# Altium schematic sheet project_V3.SchDoc
size A0
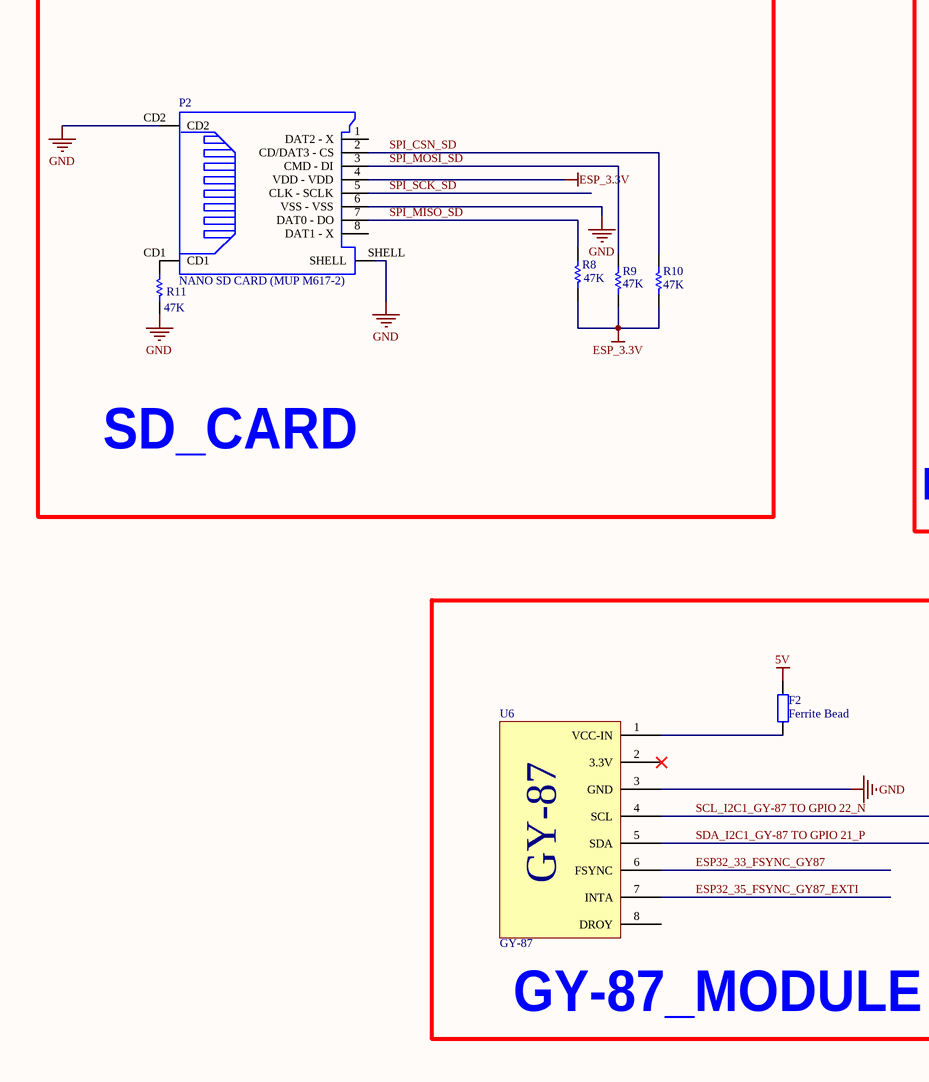
[diagram p0: project_V3.SchDoc, top left]
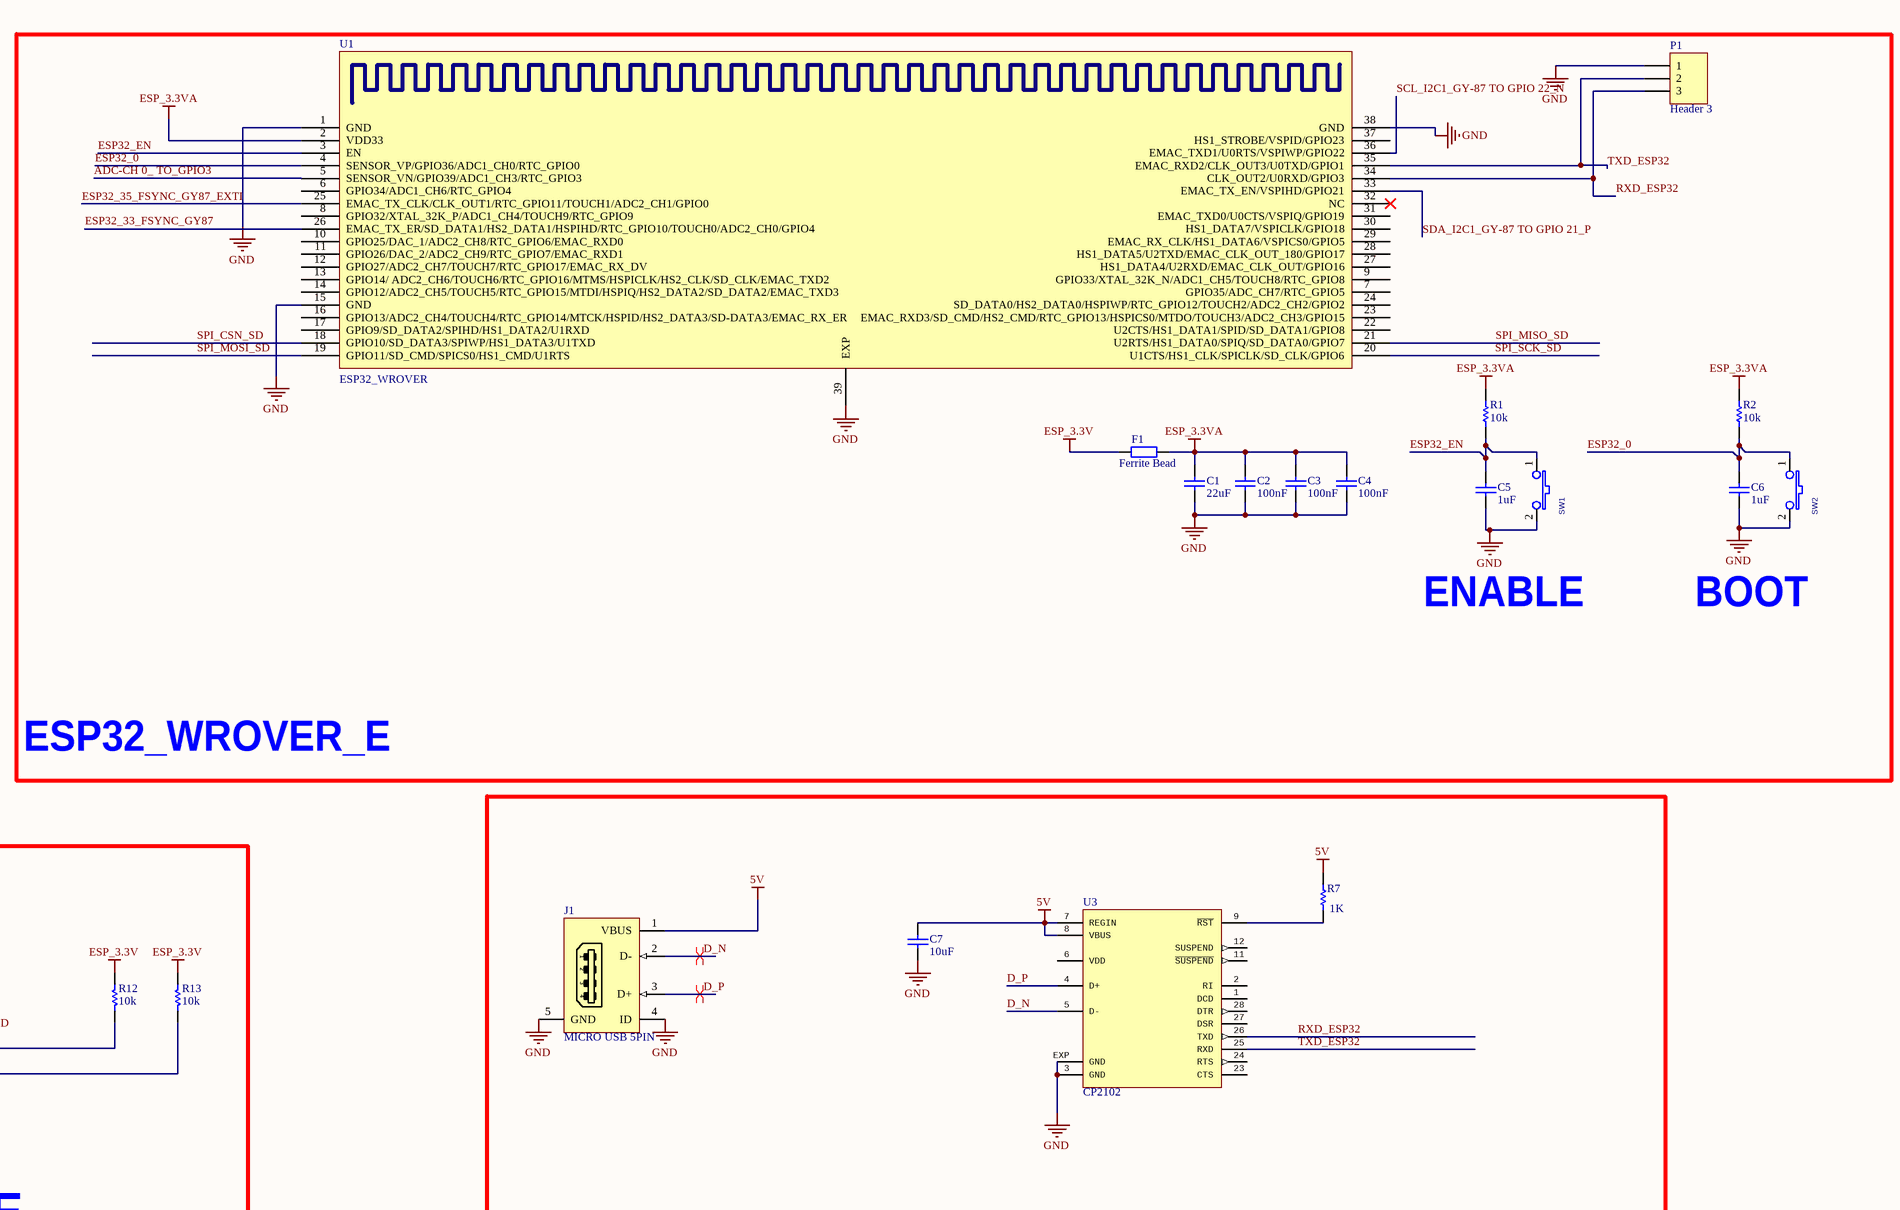
[diagram p1: project_V3.SchDoc, top right]
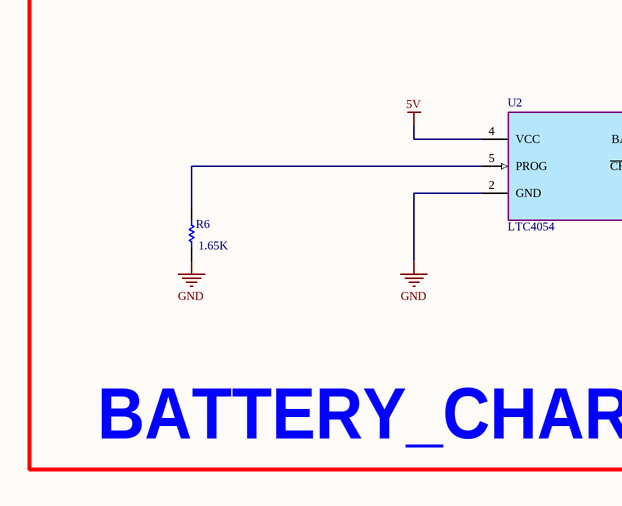
[diagram p2: project_V3.SchDoc, bottom left]
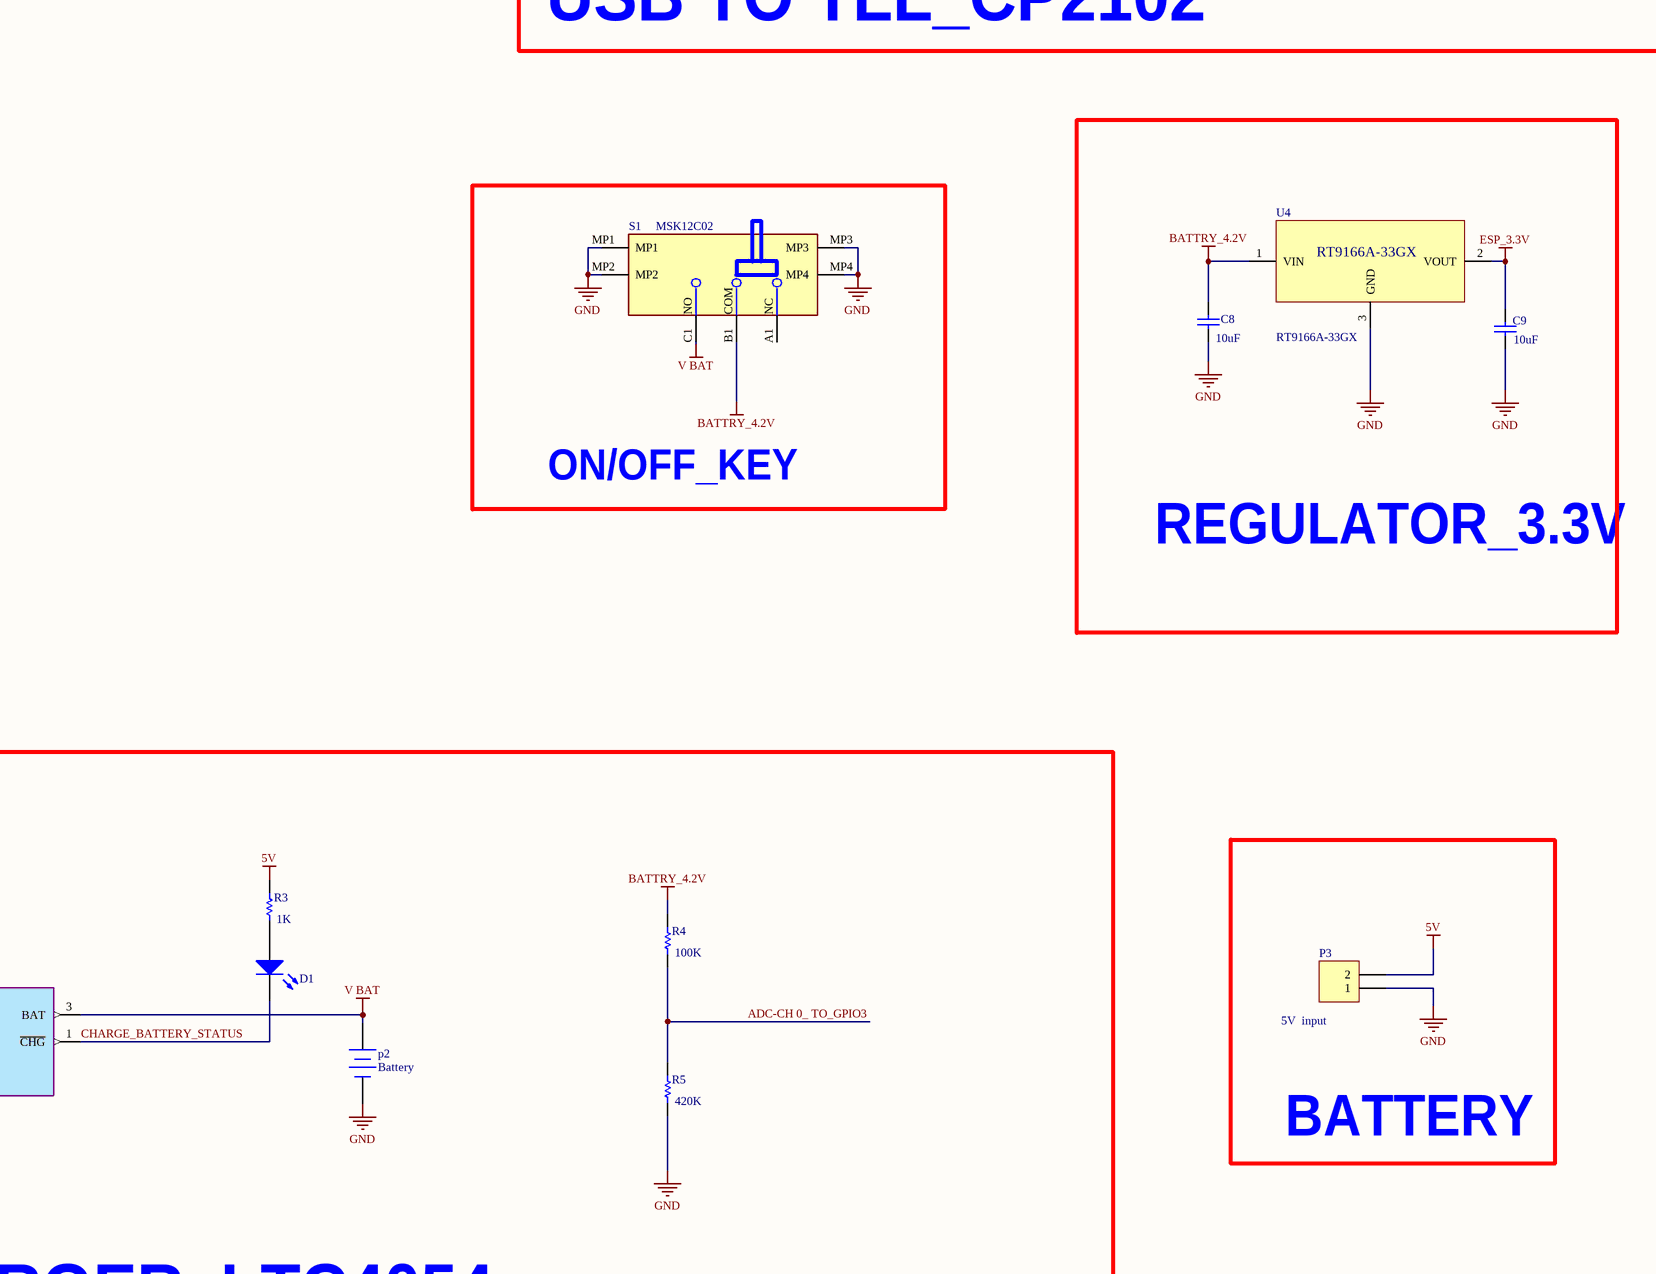
[diagram p3: project_V3.SchDoc, bottom right]

## Parts
(Parts that share a designator on the sheet are numbered #1, #2 ... from top to bottom, then left to right.)
C1  22uF  [0805 - CAP - duplicate]
C2  100nF  [0805 - CAP - duplicate]
C3  100nF  [0805 - CAP - duplicate]
C4  100nF  [0805 - CAP - duplicate]
C5  1uF  [0805 - CAP - duplicate]
C6  1uF  [0805 - CAP - duplicate]
C7  10uF  [0805 - CAP - duplicate]
C8  10uF  [0805 - CAP - duplicate]
C9  10uF  [0805 - CAP - duplicate]
D1  RED  [0603 -LED_GREEN]  (value not drawn)
F1  Ferrite Bead  [0805 - CAP - duplicate]
F2  Ferrite Bead  [0805 - CAP - duplicate]
J1  MICRO USB 5PIN  [MICRO USB Dip_5pin - duplicate]
P1  Header 3  [HDR1*3]
P2#1  NANO SD CARD (MUP M617-2)  [NANO_SDCARD]
p2#2  Battery  [HDR1X2_SMD - THD]
P3  5V  input  [HDR1X2_SMD - THD]
R1  10k  [0805 - CAP - duplicate]
R2  10k  [0805 - CAP - duplicate]
R3  1K  [0805 - CAP - duplicate]
R4  100K  [0805 - CAP - duplicate]
R5  420K  [0805 - CAP - duplicate]
R6  1.65K  [0805 - CAP - duplicate]
R7  1K  [0805 - CAP - duplicate]
R8  47K  [0805 - CAP - duplicate]
R9  47K  [0805 - CAP - duplicate]
R10  47K  [0805 - CAP - duplicate]
R11  47K  [0805 - CAP - duplicate]
R12  10k  [0805 - CAP - duplicate]
R13  10k  [0805 - CAP - duplicate]
S1  MSK12C02  [SW_ON-OFF_MSK12C02]
SW1  KFC-6X6X4.5-4P  [PUSH_BUTTON_SMD]  (value not drawn)
SW2  KFC-6X6X4.5-4P  [PUSH_BUTTON_SMD]  (value not drawn)
U1  ESP32_WROVER  [ESP32-WROVER-I]
U2  LTC4054  [TSOT-23-5]
U3  CP2102  [QFN28]
U4  RT9166A-33GX  [SOT89 (RT9166)]
U6  GY-87  [GY-87]

## Blocks framed on the sheet
SD_CARD: P2#1 R8-R11
USB TO TLL_CP2102: C7 J1 R7 U3
GY-87_MODULE: F2 R12 R13 U6
REGULATOR_3.3V: C8 C9 U4
ON/OFF_KEY: S1
BATTERY_CHARGER_LTC4054: D1 p2#2 R3-R6 U2
BATTERY: P3

## Nets
5V: C7.1 F2.1 J1.1(VBUS) P3.2 R3.1 R7.1 U2.4(VCC) U3.7(REGIN) U3.8(VBUS)
BATTRY_4.2V: C8.2 R4.1 S1.B1(COM) U4.1(VIN)
ESP_3.3V: C9.1 F1.2 P2#1.4(VDD_-_VDD) R8.2 R9.2 R10.2 R12.2 R13.2 U4.2(VOUT)
ESP_3.3VA: C1.2 C2.1 C3.1 C4.1 F1.1 R1.1 R2.1 U1.2(VDD33)
GND: C1.1 C2.2 C3.2 C4.2 C5.2 C6.2 C7.2 C8.1 C9.2 J1.4(ID) J1.5(GND) P1.1 P2#1.6(VSS_-_VSS) P2#1.CD2 P2#1.SHELL p2#2.1(-) P3.1 R5.2 R6.2 R11.2 S1.MP1 S1.MP2 S1.MP3 S1.MP4 SW1.2 SW2.2 U1.1(GND) U1.15(GND) U1.38(GND) U1.39(EXP) U2.2(GND) U3.3(GND) U3.EXP(GND) U4.3(GND) U6.3(GND)
V BAT: p2#2.2(+) S1.C1(NO) U2.3(BAT)
ADC-CH 0_ TO_GPIO3: R4.2 R5.1 U1.5(SENSOR_VN/GPIO39/ADC1_CH3/RTC_GPIO3)
CHARGE_BATTERY_STATUS: D1.2(K) U2.1(~{C}H~{G})
D_N: J1.2(D-) U3.5(D-)
D_P: J1.3(D+) U3.4(D+)
ESP32_0: C6.1 R2.2 SW2.1 U1.4(SENSOR_VP/GPIO36/ADC1_CH0/RTC_GPIO0)
ESP32_33_FSYNC_GY87: U1.26(EMAC_TX_ER/SD_DATA1/HS2_DATA1/HSPIHD/RTC_GPIO10/TOUCH0/ADC2_CH0/GPIO4) U6.6(FSYNC)
ESP32_35_FSYNC_GY87_EXTI: U1.25(EMAC_TX_CLK/CLK_OUT1/RTC_GPIO11/TOUCH1/ADC2_CH1/GPIO0) U6.7(INTA)
ESP32_EN: C5.1 R1.2 SW1.1 U1.3(EN)
RXD_ESP32: P1.3 U1.34(CLK_OUT2/U0RXD/GPIO3) U3.26(TXD)
SCL_I2C1_GY-87 TO GPIO 22_N: R12.1 U1.36(EMAC_TXD1/U0RTS/VSPIWP/GPIO22) U6.4(SCL)
SDA_I2C1_GY-87 TO GPIO 21_P: R13.1 U1.33(EMAC_TX_EN/VSPIHD/GPIO21) U6.5(SDA)
SPI_CSN_SD: P2#1.2(CD/DAT3_-_CS) R10.1 U1.18(GPIO10/SD_DATA3/SPIWP/HS1_DATA3/U1TXD)
SPI_MISO_SD: P2#1.7(DAT0_-_DO) R8.1 U1.21(U2RTS/HS1_DATA0/SPIQ/SD_DATA0/GPIO7)
SPI_MOSI_SD: P2#1.3(CMD_-_DI) R9.1 U1.19(GPIO11/SD_CMD/SPICS0/HS1_CMD/U1RTS)
SPI_SCK_SD: P2#1.5(CLK_-_SCLK) U1.20(U1CTS/HS1_CLK/SPICLK/SD_CLK/GPIO6)
TXD_ESP32: P1.2 U1.35(EMAC_RXD2/CLK_OUT3/U0TXD/GPIO1) U3.25(RXD)
NetD1_1: D1.1(A) R3.2
NetF2_2: F2.2 U6.1(VCC-IN)
NetP2#1_CD1: P2#1.CD1 R11.1
NetR6_1: R6.1 U2.5(PROG)
NetR7_2: R7.2 U3.9(~{RST})

Not connected (* = marked no-connect by the designer): J1 6(SHLD); P2#1 1(DAT2_-_X) 8(DAT1_-_X); S1 A1(NC); U1 6(GPIO34/ADC1_CH6/RTC_GPIO4) 7(GPIO35/ADC_CH7/RTC_GPIO5) 8(GPIO32/XTAL_32K_P/ADC1_CH4/TOUCH9/RTC_GPIO9) 9(GPIO33/XTAL_32K_N/ADC1_CH5/TOUCH8/RTC_GPIO8) 10(GPIO25/DAC_1/ADC2_CH8/RTC_GPIO6/EMAC_RXD0) 11(GPIO26/DAC_2/ADC2_CH9/RTC_GPIO7/EMAC_RXD1) 12(GPIO27/ADC2_CH7/TOUCH7/RTC_GPIO17/EMAC_RX_DV) 13(GPIO14/_ADC2_CH6/TOUCH6/RTC_GPIO16/MTMS/HSPICLK/HS2_CLK/SD_CLK/EMAC_TXD2) 14(GPIO12/ADC2_CH5/TOUCH5/RTC_GPIO15/MTDI/HSPIQ/HS2_DATA2/SD_DATA2/EMAC_TXD3) 16(GPIO13/ADC2_CH4/TOUCH4/RTC_GPIO14/MTCK/HSPID/HS2_DATA3/SD-DATA3/EMAC_RX_ER) 17(GPIO9/SD_DATA2/SPIHD/HS1_DATA2/U1RXD) 22(U2CTS/HS1_DATA1/SPID/SD_DATA1/GPIO8) 23(EMAC_RXD3/SD_CMD/HS2_CMD/RTC_GPIO13/HSPICS0/MTDO/TOUCH3/ADC2_CH3/GPIO15) 24(SD_DATA0/HS2_DATA0/HSPIWP/RTC_GPIO12/TOUCH2/ADC2_CH2/GPIO2) 27(HS1_DATA4/U2RXD/EMAC_CLK_OUT/GPIO16) 28(HS1_DATA5/U2TXD/EMAC_CLK_OUT_180/GPIO17) 29(EMAC_RX_CLK/HS1_DATA6/VSPICS0/GPIO5) 30(HS1_DATA7/VSPICLK/GPIO18) 31(EMAC_TXD0/U0CTS/VSPIQ/GPIO19) 32(NC)* 37(HS1_STROBE/VSPID/GPIO23); U3 1(DCD) 2(RI) 6(VDD) 11(~{SUSPEND}) 12(SUSPEND) 23(CTS) 24(RTS) 27(DSR) 28(DTR); U6 2(3.3V)* 8(DROY)

## Layout directives
differential pair: D_N, D_P

## Notes on the sheet
- ENABLE
- BOOT
- ESP32_WROVER_E

## Library data of the parts
C1-C6 C8 C9 = Cap: Capacitor; Published: 8-Jun-2000; LatestRevisionDate: 17-Jul-2002; LatestRevisionNote: Re-released for DXP Platform.; PackageReference: RAD-0.3; Publisher: Altium Limited; PackageDescription: Radial Cap, Thru-Hole; 2 Leads; 0.3 in Pin Spacing
  C1: Value: 22uF
  C2-C4: Value: 100nF
  C5 C6: Value: 1uF
  C8 C9: Value: 10uF
C7 = C SMD: Ceramic Chip Capacitor - Standard; Note: Footprint corresponds to dimensions for bulk cassette packaging. This case size has tightened tolerances.; Published: 17-Jul-2002; LatestRevisionDate: 19-Mar-2004; LatestRevisionNote: Silkscreen size reduced.; DatasheetDocument: Mar-2001; PackageDocument: Mar-2001; PackageReference: 0603; Publisher: Altium Limited; Code_JEITA: 0603; Code_IPC: 1608 [0603]; ComponentLink1Description: Manufacturer Link; ComponentLink1URL: http://www.kemet.com/; ComponentLink2Description: Datasheet; ComponentLink2URL: http://www.kemet.com/kemet/web/homepage/kechome.nsf/vapubfilesname/F3102TA.pdf/$file/F3102TA.pdf; Value: 10uF
D1 = LED SMD
F1 F2 = Res2: Resistor; Value: 1K; Published: 8-Jun-2000; LatestRevisionDate: 17-Jul-2002; LatestRevisionNote: Re-released for DXP Platform.; PackageReference: AXIAL-0.4; Publisher: Altium Limited
J1 = MICRO USB 5PIN: USB 1.1, Right Angle, Thru-Hole, Series A, Reverse Type, Receptacle, 4 Position, Black; ContactMaterial: Copper Alloy; ContactPlating: Gold (30); TerminationLength: 2.79mm [0.110in.]; PCB_Layout: Complies with manufacturer's recommendation.; DrillSize: Corresponds to nominal value.; PanelGround: Without; Published: 15-Jul-2004; DatasheetDocument: 08-Sep-2003; PackageDocument: 08-Sep-2003; PackageReference: 440314; Publisher: Altium Limited; HousingMaterial: Glass-Filled Thermoplastic; ComponentLink1Description: Manufacturer Link; ComponentLink1URL: http://www.tycoelectronics.com/; ComponentLink2Description: Packaging Specification; ComponentLink2URL: http://ecommas.tycoelectronics.com/commerce/DocumentDelivery/DDEController?Action=showdoc&DocId=Customer+Drawing%7F440314%7FF%7Ftif%7FEnglish%7FC_440314_F.tif
P1 = Header 3: Header, 3-Pin; LatestRevisionDate: 17-Jul-2002; LatestRevisionNote: Re-released for DXP Platform.; Publisher: Altium Limited
P2#1 = Nano_SDCard: Manufacturer: *; Package: *; Unit Price: *; Vendor: *
p2#2 = Battery: Multicell Battery; Published: 24-Mar-1999; LatestRevisionDate: 17-Jul-2002; LatestRevisionNote: Re-released for DXP Platform.; PackageReference: BAT-2; Publisher: Altium Limited; PackageDescription: Battery; 2 Leads
P3 = Header 2: Header, 2-Pin; LatestRevisionDate: 17-Jul-2002; LatestRevisionNote: Re-released for DXP Platform.; Publisher: Altium Limited
R1-R13 = Res1: Resistor; Published: 8-Jun-2000; LatestRevisionDate: 17-Jul-2002; LatestRevisionNote: Re-released for DXP Platform.; PackageReference: AXIAL-0.3; Publisher: Altium Limited; PackageDescription: Axial Device, Thru-Hole; 2 Leads; 0.3 in Pin Spacing
  R1 R2 R12 R13: Value: 10k
  R3 R7: Value: 1K
  R4: Value: 100K
  R5: Value: 420K
  R6: Value: 1.65K
  R8-R11: Value: 47K
S1 = MSK12C02_1: Switch; Manufacturer_Name: Shou Han; Datasheet Link: https://shouhan.en.made-in-china.com/product/xsMEmqgOAXWB/China-Slide-Switch-Msk12c02-Slide-Switch-on-off-2-Position-1p2t-Spdt-Miniature-Horizontal-SMD-7p-Slide-Switch.html; Height: 1.4mm; Manufacturer_Part_Number: MSK12C02
SW1 SW2 = Push Bottun
U2 = LTC4054: Standalone Linear  Li-Ion Battery Charger with  Thermal Regulation in ThinSOT; mahdi zamani: 23.aug.2017; linear datasheet: http://www.linear.com/docs/2288
U3 = CP2102N-A01-GQFN20R: Integrated Circuit; Manufacturer_Name: Silicon Labs; Datasheet Link: http://www.silabs.com/documents/public/data-sheets/cp2102n-datasheet.pdf; Height: 0.8mm; Manufacturer_Part_Number: CP2102N-A01-GQFN20R; Arrow Part Number: CP2102N-A01-GQFN20R; Arrow Price/Stock: https://www.arrow.com/en/products/cp2102n-a01-gqfn20r/silicon-labs; Mouser Part Number: 634-CP21NA01GQFN20R; Mouser Price/Stock: https://www.mouser.co.uk/ProductDetail/Silicon-Labs/CP2102N-A01-GQFN20R?qs=eDRjYdeUVVk8quRq31jmtA%3D%3D
U4 = RT9166A-33GX: REGULATOR 3.3V; Manufacturer_Name: Vishay; Manufacturer_Part_Number: 2N7002; Datasheet Link: https://www.diodes.com/assets/Datasheets/ds11303.pdf; Height: 1.2mm; Mouser Part Number: 781-2N7002; Mouser Price/Stock: https://www.mouser.com/Search/Refine.aspx?Keyword=781-2N7002; RS Part Number: 2370907P; RS Price/Stock: http://uk.rs-online.com/web/p/products/2370907P
U6 = GY-87: Gyroscope Module                                                                         #include <Wire.h> / #include <Adafruit_MPU6050.h> / Adafruit_MPU6050 mpu; / void setup() { / Wire.begin(); / mpu.begin(); / } / void loop() { / sensors_event_t a, g, temp; / mpu.getEvent(&a, &g, &temp); / float accelerationX = a.acceleration.x; / float accelerationY = a.acceleration.y; / float accelerationZ = a.acceleration.z; / float gyroX = g.gyro.x; / float gyroY = g.gyro.y; / float gyroZ = g.gyro.z; / float temperature = temp.temperature; / // Process sensor data here / delay(100); / }*/